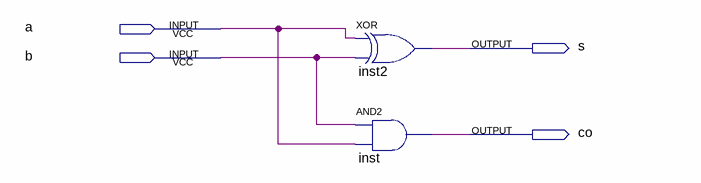
[diagram p0: schematic sheet]
// Quartus schematic Pratica01_01.bdf as structural Verilog: 2 symbols, 4 pins
module Pratica01_01 (
  input  a,
  input  b,
  output s,
  output co
);

  xor inst2 (s, a, b);
  and inst (co, b, a);
endmodule
